# Altium schematic sheet 01-USER_IO.SchDoc
size Tabloid; DocumentNumber: 1; SheetNumber: 1; SheetTotal: 16
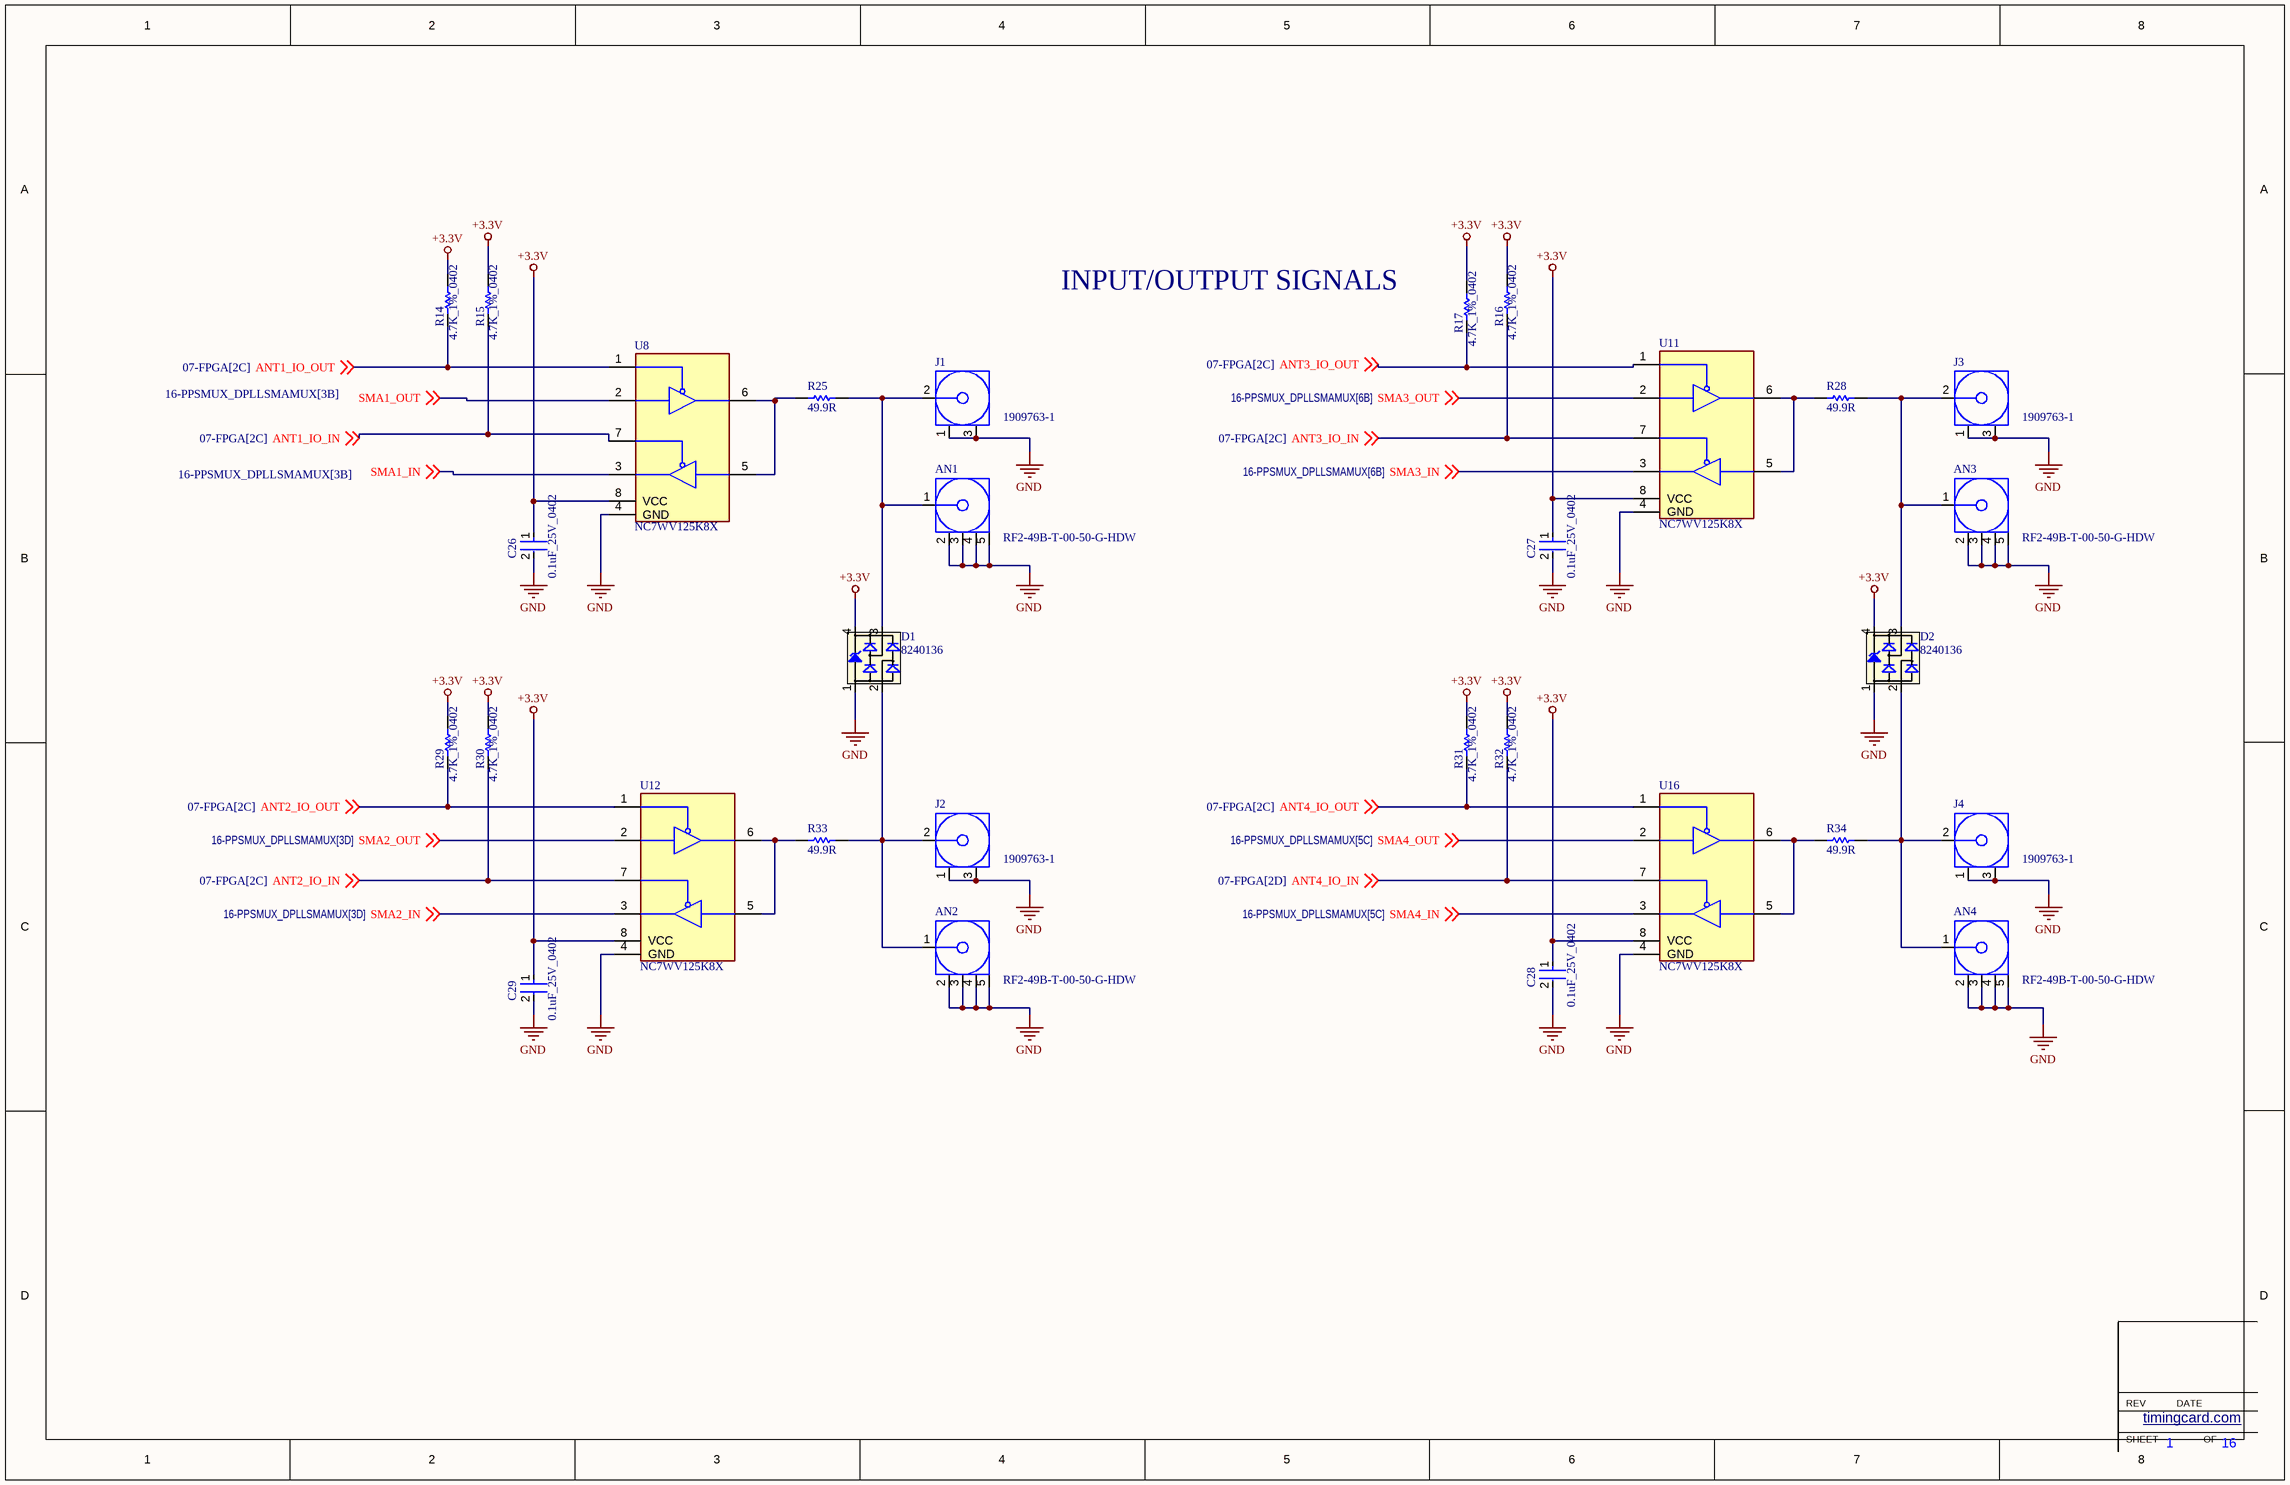
[diagram p0: 01-USER_IO.SchDoc]

## Parts
AN1  RF2-49B-T-00-50-G-HDW  [AMPH-901-143-6RFX_V]
AN2  RF2-49B-T-00-50-G-HDW  [AMPH-901-143-6RFX_V]
AN3  RF2-49B-T-00-50-G-HDW  [AMPH-901-143-6RFX_V]
AN4  RF2-49B-T-00-50-G-HDW  [AMPH-901-143-6RFX_V]
C26  0.1uF_25V_0402  [FP-0402-L_1_0_1-W_0_5_0_1-IPC_C]
C27  0.1uF_25V_0402  [FP-0402-L_1_0_1-W_0_5_0_1-IPC_C]
C28  0.1uF_25V_0402  [FP-0402-L_1_0_1-W_0_5_0_1-IPC_C]
C29  0.1uF_25V_0402  [FP-0402-L_1_0_1-W_0_5_0_1-IPC_C]
D1  8240136  [SOT143-4L]
D2  8240136  [SOT143-4L]
J1  1909763-1  [TECO-1909763-1_V]
J2  1909763-1  [TECO-1909763-1_V]
J3  1909763-1  [TECO-1909763-1_V]
J4  1909763-1  [TECO-1909763-1_V]
R14  4.7K_1%_0402  [RESC1005X40X25NL10T10]
R15  4.7K_1%_0402  [RESC1005X40X25NL10T10]
R16  4.7K_1%_0402  [RESC1005X40X25NL10T10]
R17  4.7K_1%_0402  [RESC1005X40X25NL10T10]
R25  49.9R  [RESC1608X55X25NL10T15]
R28  49.9R  [RESC1608X55X25NL10T15]
R29  4.7K_1%_0402  [RESC1005X40X25NL10T10]
R30  4.7K_1%_0402  [RESC1005X40X25NL10T10]
R31  4.7K_1%_0402  [RESC1005X40X25NL10T10]
R32  4.7K_1%_0402  [RESC1005X40X25NL10T10]
R33  49.9R  [RESC1608X55X25NL10T15]
R34  49.9R  [RESC1608X55X25NL10T15]
U8  NC7WV125K8X  [SOP50P310X90-8N]
U11  NC7WV125K8X  [SOP50P310X90-8N]
U12  NC7WV125K8X  [SOP50P310X90-8N]
U16  NC7WV125K8X  [SOP50P310X90-8N]

## Nets
+3.3V: C26.1 C27.1 C28.1 C29.1 D1.4(VDD) D2.4(VDD) R14.1 R15.1 R16.1 R17.1 R29.1 R30.1 R31.1 R32.1 U8.8(VCC) U11.8(VCC) U12.8(VCC) U16.8(VCC)
GND: AN1.2 AN1.3 AN1.4 AN1.5 AN2.2 AN2.3 AN2.4 AN2.5 AN3.2 AN3.3 AN3.4 AN3.5 AN4.2 AN4.3 AN4.4 AN4.5 C26.2 C27.2 C28.2 C29.2 D1.1(GND) D2.1(GND) J1.1 J1.3 J2.1 J2.3 J3.1 J3.3 J4.1 J4.3 U8.4(GND) U11.4(GND) U12.4(GND) U16.4(GND)
ANT1_IO_IN: R15.2 U8.7 ; off-sheet ANT1_IO_IN
ANT1_IO_OUT: R14.2 U8.1 ; off-sheet ANT1_IO_OUT
ANT2_IO_IN: R30.2 U12.7 ; off-sheet ANT2_IO_IN
ANT2_IO_OUT: R29.2 U12.1 ; off-sheet ANT2_IO_OUT
ANT3_IO_IN: R16.2 U11.7 ; off-sheet ANT3_IO_IN
ANT3_IO_OUT: R17.2 U11.1 ; off-sheet ANT3_IO_OUT
ANT4_IO_IN: R32.2 U16.7 ; off-sheet ANT4_IO_IN
ANT4_IO_OUT: R31.2 U16.1 ; off-sheet ANT4_IO_OUT
SMA1_IN: U8.3 ; off-sheet SMA1_IN
SMA1_OUT: U8.2 ; off-sheet SMA1_OUT
SMA2_IN: U12.3 ; off-sheet SMA2_IN
SMA2_OUT: U12.2 ; off-sheet SMA2_OUT
SMA3_IN: U11.3 ; off-sheet SMA3_IN
SMA3_OUT: U11.2 ; off-sheet SMA3_OUT
SMA4_IN: U16.3 ; off-sheet SMA4_IN
SMA4_OUT: U16.2 ; off-sheet SMA4_OUT
NetAN1_1: AN1.1 D1.3(I/O2) J1.2 R25.2
NetAN2_1: AN2.1 D1.2(I/O1) J2.2 R33.2
NetAN3_1: AN3.1 D2.3(I/O2) J3.2 R28.2
NetAN4_1: AN4.1 D2.2(I/O1) J4.2 R34.2
NetR25_1: R25.1 U8.5 U8.6
NetR28_1: R28.1 U11.5 U11.6
NetR33_1: R33.1 U12.5 U12.6
NetR34_1: R34.1 U16.5 U16.6

## Notes on the sheet
- INPUT/OUTPUT SIGNALS
- SHEET
- REV
- timingcard.com <http://timingcard.com>
- DATE
- OF

## Library data of the parts
AN1-AN4 = CMP-2000-05705-1: Coaxial connector, 50 Ohm, -65 to 165 degC, 5-Pin THD, RoHS, Bulk; Manufacturer: Amphenol; Catalog Drawings: 901-143-6RFXMountingHole; 3D Model: 901-143-6RFX.igs; Body Material: Brass; Connector Type: Jack,FemaleSocket; Shield Termination: Solder; Other Names: 901-143-6-RFX9011436RFXARFX1232; Online Catalog: SMA,RFX; Frequency - Max: 18GHz; Body Finish: Gold; Dielectric Material: Polytetrafluoroethylene(PTFE); Center Contact Material: BerylliumCopper; Impedance: 50Ohm; Connector Style: SMA; Mounting Technology: ThroughHole; Mounting Type: ThroughHole,RightAngle; Cable Group: -; Series: -; Package Description: 5-Pin Through Hole Device, Body 7 x 7 mm, Pitch 2.54 mm; Package Reference: 901-143-6RFX; Voltage Rating: -; Standard Package: 1; Fastening Type: Threaded; Housing Color: Gold; Datasheet URL: http://www.amphenolrf.com/downloads/dl/file/id/2712/product/3102/901_143_6rfx_customer_drawing.pdf; Family: CoaxialConnectors(RF); Contact Termination: Solder; Manufacturer URL: http://www.amphenol.com/; Operating Temperature: -65°C~165°C; Category: Connectors,Interconnects; Packaging: Bulk; Features: -; Center Contact Plating: Gold; Datasheet Version: Rev. C, 06/2010; Ingress Protection: -
C26-C29 = CMP-2008-02519-2: General Purpose Ceramic Capacitor, 0402, 100nF, 10%, X7R, 15%, 25V; Package Quantity: 1; Capacitance: 100nF; Min Operating Temperature: -55°C; Voltage: 25V; Voltage Rating: 25V; Construction: Flat; Max Operating Temperature: 125°C; Radiation Hardening: No; Depth: 0.5mm; Thickness: 0.022inch; Voltage Rating (DC): 25V; Number of Pins: 2; Lead Free: Lead Free; Series: -; REACH SVHC: No SVHC; Length: 1mm; Dielectric: X7R; RoHS Compliant: Yes; Mount: Surface Mount; Packaging: Tape and Reel; Case/Package: 0402; Case Code (Imperial): 0402; Termination: SMD/SMT; Width: 0.02inch; Case Code (Metric): 1005; Tolerance: 10%
D1 D2 = CMP-1486-00002-1: TVS Diode WE-TVS-HS, VRWM=3.3V; Manufacturer: Wuerth Elektronik; Reverse Stand Off Voltage: 3.3V; PartNumber: 8240136; ComponentLink1Description: Manufacturer URL; PackageReference: SOT143-4L; ComponentLink1URL: http://www.we-online.com; ComponentLink2Description: Datasheet; ComponentLink2URL: http://katalog.we-online.de/kataloge/eisos/media/pdf/8240136.pdf
J1-J4 = CMP-2000-07505-1: Ultra Miniature Coaxial Connector Jack, 60 V, 50 Ohm, -40 to 90 degC, RoHS, Tape and Reel; Manufacturer: TE Connectivity; Gender: Female; PCB Mounting Orientation: Vertical; Body Material: LiquidCrystalPolymer; Case\/Package: SMD/SMT; Impedance: 50Ohm; Max Frequency: 6GHz; Body Plating: Gold; Dielectric Material: Polymer; Orientation: Straight; Mount: SurfaceMount; Length: 3mm; Packaging: TapeandReel; Connector Type: Jack; Lead Free: LeadFree; Package Quantity: 1; Termination: SMD/SMT; Contact Material: CopperAlloy; Fastening Type: Pull; RoHSCompliant: true; Max Operating Temperature: 90degC; Datasheet URL: http://www.te.com/commerce/DocumentDelivery/DDEController?Action=srchrtrv&DocNm=1909763&DocType=Customer+Drawing&DocLang=English; Contact Plating: Gold; Mounting Technology: SurfaceMount; Package Reference: TECO-1909763-1; Insulation Material: Thermoplastic; Min Operating Temperature: -40degC; Manufacturer URL: http://www.te.com/; ELV: Compliant; Datasheet Version: Rev. B2, 11/2015; Radiation Hardening: No; Package Description: 3-Pin Surface Mount Device, Body 2.6 x 2.6 mm; Housing Colour: Beige
R14-R17 R29-R32 = CMP-2002-05217-1: Manufacturer: Bourns; Part Number: CR0402-FX-4701GLF
R25 R28 R33 R34 = CMP-1659-00036-1: General Purpose Chip Resistor, 49.9 Ohm, +/- 1%, -55 to 155 degC, 0603 (1608 Metric), RoHS, Tape and Reel; Max Supply Voltage: 3.63 V; Case\Package: LQFP; Interface: SPI; Min Supply Voltage: 2.97 V; PackageReference: 0603; Packaging: Tray; ComponentLink2Description: Datasheet; ComponentLink1Description: Manufacturer URL; ComponentLink2URL: https://datasheet.ciiva.com/11808/0900766b80f96399-11808223.pdf; RoHSCompliant: true; Max Operating Temperature: 85 degC; ComponentLink1URL: http://www.yageo.com/; PackageDescription: 2-Pin Surface Mount Device, Body 1.6 x 0.8 mm; DatasheetVersion: Rev. 4, 04/2009; Min Operating Temperature: -40 degC; Package Quantity: 250; Pins: 48
U8 U11 U12 U16 = NC7WV125K8X: Integrated Circuit; Manufacturer_Name: ON Semiconductor; Datasheet Link: https://www.mouser.com/datasheet/2/308/NC7WV125-1301459.pdf; Height: 0.9mm; Manufacturer_Part_Number: NC7WV125K8X; Mouser Part Number: 512-NC7WV125K8X; Mouser Price/Stock: https://www.mouser.com/Search/Refine.aspx?Keyword=512-NC7WV125K8X; Arrow Part Number: NC7WV125K8X; Arrow Price/Stock: https://www.arrow.com/en/products/nc7wv125k8x/on-semiconductor